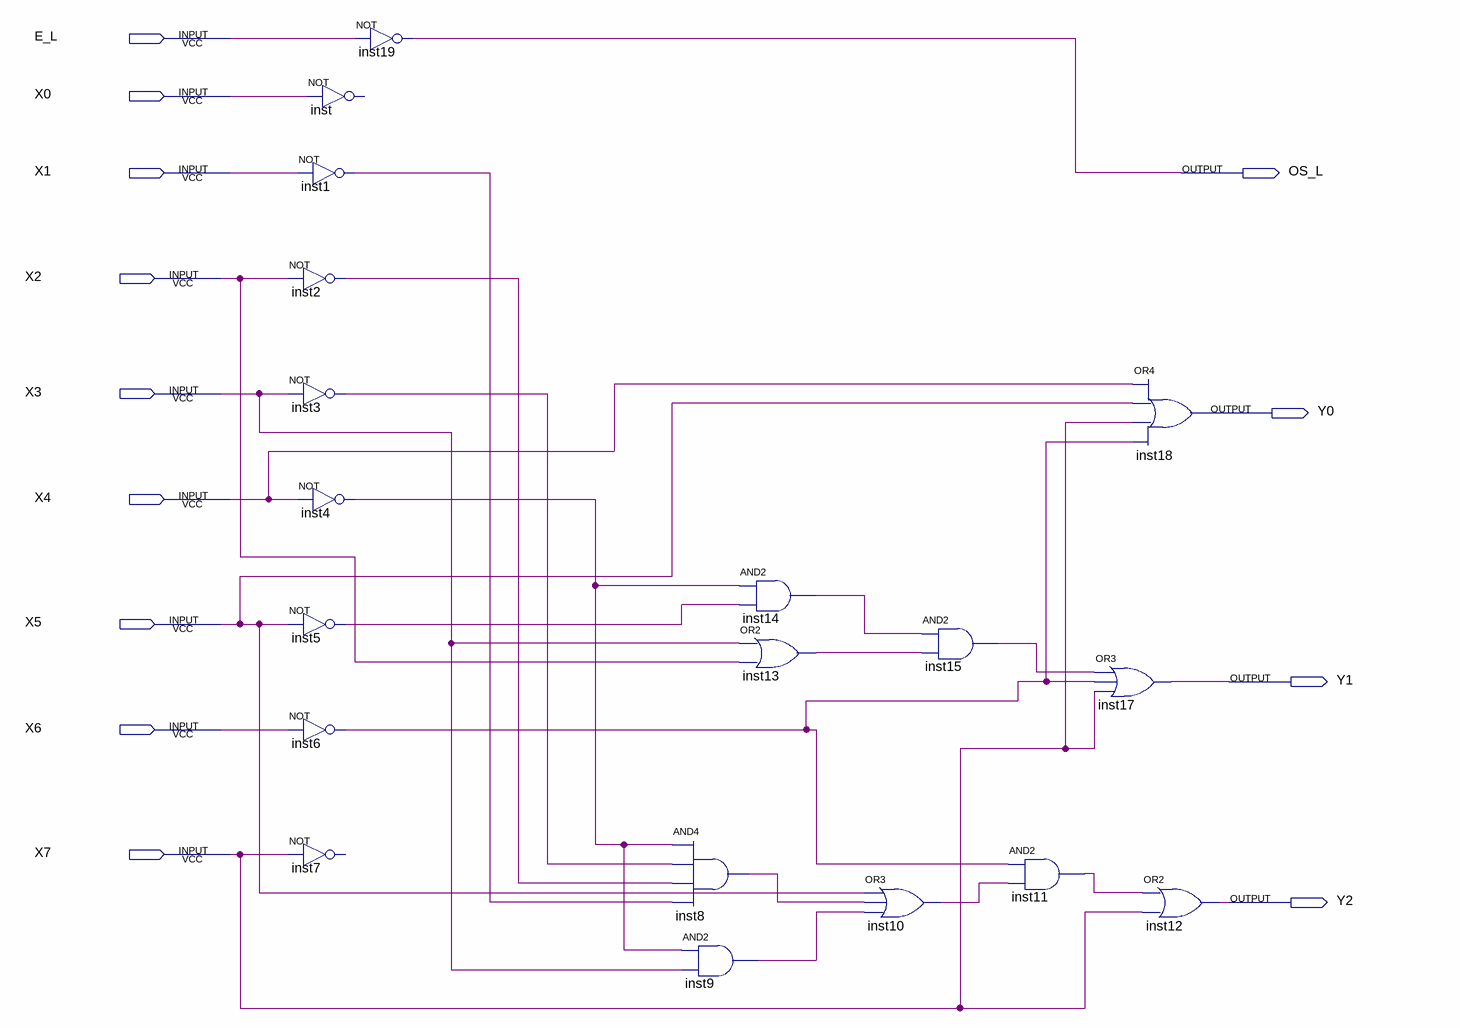
[diagram p0: schematic sheet]
// Quartus schematic PEnc8_3.bdf as structural Verilog: 19 symbols, 13 pins
module PEnc8_3 (
  input  E_L,
  input  X0,
  input  X1,
  input  X2,
  input  X3,
  input  X4,
  input  X5,
  input  X6,
  input  X7,
  output OS_L,
  output Y0,
  output Y1,
  output Y2
);

  wire inst1_out, inst2_out, inst3_out, inst4_out, inst5_out, inst6_out, inst8_out, inst9_out, inst10_out,
       inst11_out, inst13_out, inst14_out, inst15_out;

  // NOT inst has open pins: IN=X0, OUT=open
  not inst1 (inst1_out, X1);
  not inst2 (inst2_out, X2);
  not inst3 (inst3_out, X3);
  not inst4 (inst4_out, X4);
  not inst5 (inst5_out, X5);
  not inst6 (inst6_out, X6);
  // NOT inst7 has open pins: IN=X7, OUT=open
  not inst19 (OS_L, E_L);
  and inst8 (inst8_out, inst4_out, inst3_out, inst2_out, inst1_out);
  and inst9 (inst9_out, inst4_out, X3);
  and inst14 (inst14_out, inst4_out, inst5_out);
  or inst13 (inst13_out, X3, X2);
  or inst10 (inst10_out, X5, inst8_out, inst9_out);
  and inst15 (inst15_out, inst14_out, inst13_out);
  and inst11 (inst11_out, inst6_out, inst10_out);
  or inst17 (Y1, inst15_out, inst6_out, X7);
  or inst18 (Y0, X4, X5, X7, inst6_out);
  or inst12 (Y2, inst11_out, X7);
endmodule
